# EAGLE board TestBoardTarget (EAGLE 7.1.0)
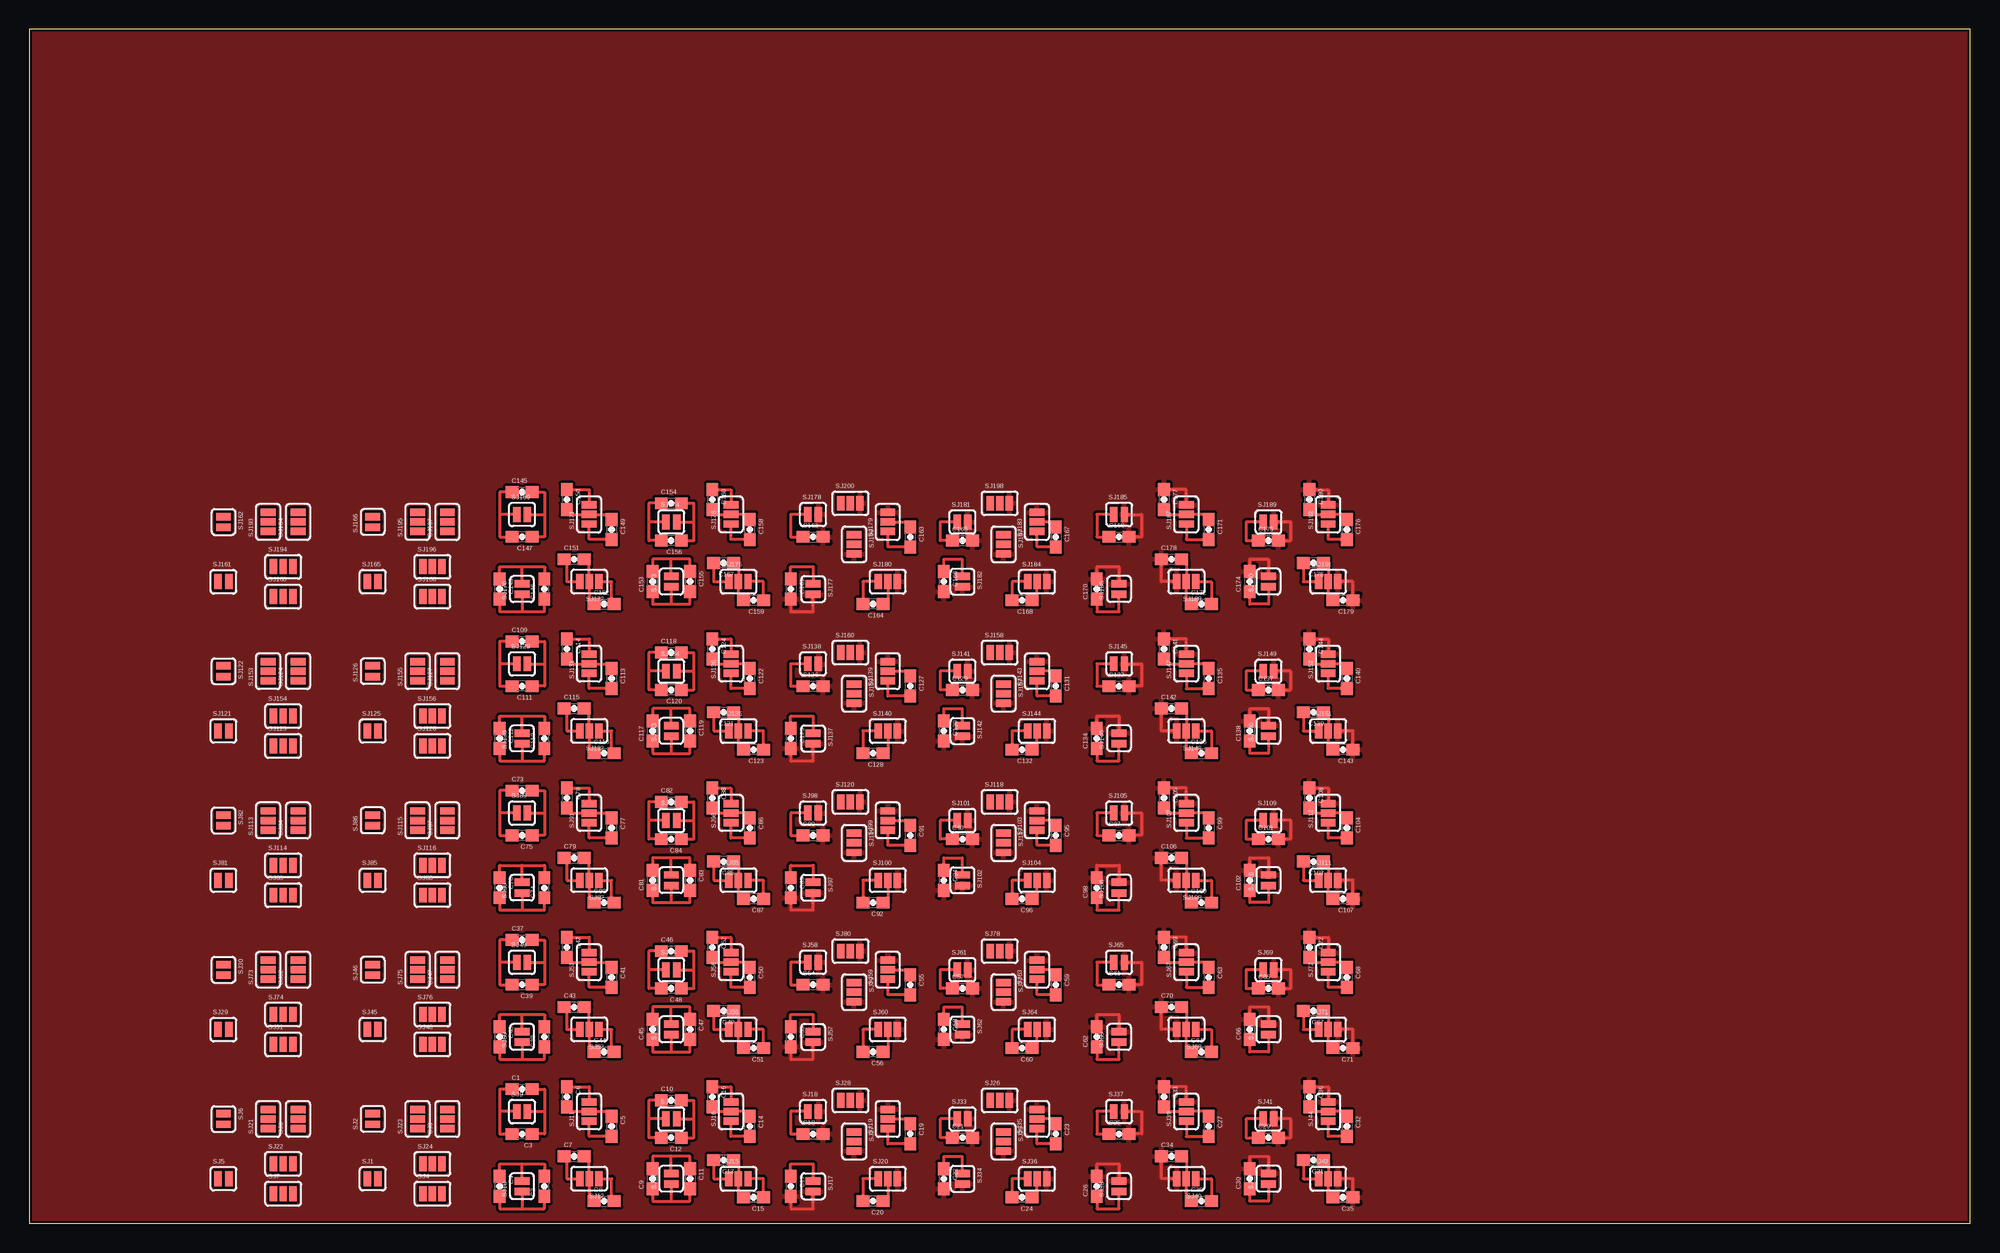
[diagram p3: board, top side]

Size 165.1 x 101.6 mm. Coordinates in mm from the lower left corner, seen from the top.
Outline: 0,0 165.1,0 165.1,101.6 0,101.6 0,0
Copper layers (1*16): Top 0.035mm / dielectric 1.5mm / Bottom 0.035mm
Design rules "SparkFun-2-layer": minimum track width 7mil, minimum drill 15mil, track to track 8mil, track to pad 8mil, pad to pad 8mil, via to via 8mil, smd to smd 8mil, copper to edge 8mil, drill to drill 8mil, minimum pad ring 12mil, minimum via ring 10mil, stop-mask expansion 4mil, vias tented up to drill 20mil, thermal gap 10mil

## Footprints (pad centres in the part's own frame; a part is rotated, then mirrored left to right if it is on the bottom)
0603-CAP = smd 1.1 x 1: 1 -0.85,0; 2 0.85,0
PAD-JUMPER-2-NO_NO_SILK = smd 0.635 x 1.27: 1 -0.45,0; 2 0.45,0
PAD-JUMPER-3-NO_YES_SILK = smd 0.635 x 1.27: 1 -0.813,0; 2 0,0; 3 0.813,0
PAD-JUMPER-3-NO_YES_SILK_ALL = smd 0.635 x 1.27: 1 -0.813,0; 2 0,0; 3 0.813,0
PAD-JUMPER-2-NO_NO_SILK_20 = smd 0.635 x 1.27: 1 -0.45,0; 2 0.45,0
PAD-JUMPER-3-NO_YES_SILK_20 = smd 0.635 x 1.27: 1 -0.813,0; 2 0,0; 3 0.813,0
PAD-JUMPER-3-NO_YES_SILK_ALL_20 = smd 0.635 x 1.27: 1 -0.813,0; 2 0,0; 3 0.813,0
PAD-JUMPER-2-NO_NO_SILK_40 = smd 0.635 x 1.27: 1 -0.45,0; 2 0.45,0
PAD-JUMPER-3-NO_YES_SILK_40 = smd 0.635 x 1.27: 1 -0.813,0; 2 0,0; 3 0.813,0
PAD-JUMPER-3-NO_YES_SILK_ALL_40 = smd 0.635 x 1.27: 1 -0.813,0; 2 0,0; 3 0.813,0
PAD-JUMPER-2-NO_NO_SILK_60 = smd 0.635 x 1.27: 1 -0.45,0; 2 0.45,0
PAD-JUMPER-3-NO_YES_SILK_60 = smd 0.635 x 1.27: 1 -0.813,0; 2 0,0; 3 0.813,0
PAD-JUMPER-3-NO_YES_SILK_ALL_60 = smd 0.635 x 1.27: 1 -0.813,0; 2 0,0; 3 0.813,0
PAD-JUMPER-2-NO_NO_SILK_80 = smd 0.635 x 1.27: 1 -0.45,0; 2 0.45,0
PAD-JUMPER-3-NO_YES_SILK_80 = smd 0.635 x 1.27: 1 -0.813,0; 2 0,0; 3 0.813,0
PAD-JUMPER-3-NO_YES_SILK_ALL_80 = smd 0.635 x 1.27: 1 -0.813,0; 2 0,0; 3 0.813,0

## Placement (x,y rotation side)
C1  0.1uF  [0603-CAP]  41.91,11.43 0 top
C2  0.1uF  [0603-CAP]  43.81,3.17 90 top
C3  0.1uF  [0603-CAP]  41.91,7.62 180 top
C4  0.1uF  [0603-CAP]  40.01,3.17 270 top
C5  0.1uF  [0603-CAP]  49.53,8.26 270 top
C6  0.1uF  [0603-CAP]  45.72,10.79 270 top
C7  0.1uF  [0603-CAP]  46.35,5.71 0 top
C8  0.1uF  [0603-CAP]  48.9,1.91 0 top
C9  0.1uF  [0603-CAP]  53.02,3.81 90 top
C10  0.1uF  [0603-CAP]  54.61,10.48 0 top
C11  0.1uF  [0603-CAP]  56.2,3.81 270 top
C12  0.1uF  [0603-CAP]  54.61,7.3 180 top
C13  0.1uF  [0603-CAP]  59.05,5.4 180 top
C14  0.1uF  [0603-CAP]  61.28,8.26 270 top
C15  0.1uF  [0603-CAP]  61.59,2.22 180 top
C16  0.1uF  [0603-CAP]  58.1,10.79 270 top
C17  0.1uF  [0603-CAP]  64.77,3.17 270 top
C18  0.1uF  [0603-CAP]  66.67,7.62 0 top
C19  0.1uF  [0603-CAP]  74.93,7.62 270 top
C20  0.1uF  [0603-CAP]  71.75,1.91 180 top
C21  0.1uF  [0603-CAP]  79.38,7.3 0 top
C22  0.1uF  [0603-CAP]  77.79,3.81 270 top
C23  0.1uF  [0603-CAP]  87.31,7.62 270 top
C24  0.1uF  [0603-CAP]  84.45,2.22 180 top
C25  0.1uF  [0603-CAP]  92.71,7.62 0 top
C26  0.1uF  [0603-CAP]  90.81,3.17 90 top
C27  0.1uF  [0603-CAP]  100.33,8.26 270 top
C28  0.1uF  [0603-CAP]  99.69,1.91 0 top
C29  0.1uF  [0603-CAP]  105.41,7.3 0 top
C30  0.1uF  [0603-CAP]  103.82,3.81 90 top
C31  0.1uF  [0603-CAP]  109.22,5.4 180 top
C32  0.1uF  [0603-CAP]  112.08,8.26 270 top
C33  0.1uF  [0603-CAP]  96.52,10.79 270 top
C34  0.1uF  [0603-CAP]  97.16,5.71 0 top
C35  0.1uF  [0603-CAP]  111.76,2.22 180 top
C36  0.1uF  [0603-CAP]  108.9,10.79 270 top
C37  0.1uF  [0603-CAP]  41.91,24.13 0 top
C38  0.1uF  [0603-CAP]  43.81,15.88 90 top
C39  0.1uF  [0603-CAP]  41.91,20.32 180 top
C40  0.1uF  [0603-CAP]  40.01,15.88 270 top
C41  0.1uF  [0603-CAP]  49.53,20.95 270 top
C42  0.1uF  [0603-CAP]  45.72,23.5 270 top
C43  0.1uF  [0603-CAP]  46.35,18.41 0 top
C44  0.1uF  [0603-CAP]  48.9,14.61 0 top
C45  0.1uF  [0603-CAP]  53.02,16.51 90 top
C46  0.1uF  [0603-CAP]  54.61,23.18 0 top
C47  0.1uF  [0603-CAP]  56.2,16.51 270 top
C48  0.1uF  [0603-CAP]  54.61,20 180 top
C49  0.1uF  [0603-CAP]  59.05,18.1 180 top
C50  0.1uF  [0603-CAP]  61.28,20.95 270 top
C51  0.1uF  [0603-CAP]  61.59,14.92 180 top
C52  0.1uF  [0603-CAP]  58.1,23.5 270 top
C53  0.1uF  [0603-CAP]  64.77,15.88 270 top
C54  0.1uF  [0603-CAP]  66.67,20.32 0 top
C55  0.1uF  [0603-CAP]  74.93,20.32 270 top
C56  0.1uF  [0603-CAP]  71.75,14.61 180 top
C57  0.1uF  [0603-CAP]  79.38,20 0 top
C58  0.1uF  [0603-CAP]  77.79,16.51 270 top
C59  0.1uF  [0603-CAP]  87.31,20.32 270 top
C60  0.1uF  [0603-CAP]  84.45,14.92 180 top
C61  0.1uF  [0603-CAP]  92.71,20.32 0 top
C62  0.1uF  [0603-CAP]  90.81,15.88 90 top
C63  0.1uF  [0603-CAP]  100.33,20.95 270 top
C64  0.1uF  [0603-CAP]  99.69,14.61 0 top
C65  0.1uF  [0603-CAP]  105.41,20 0 top
C66  0.1uF  [0603-CAP]  103.82,16.51 90 top
C67  0.1uF  [0603-CAP]  109.22,18.1 180 top
C68  0.1uF  [0603-CAP]  112.08,20.95 270 top
C69  0.1uF  [0603-CAP]  96.52,23.5 270 top
C70  0.1uF  [0603-CAP]  97.16,18.41 0 top
C71  0.1uF  [0603-CAP]  111.76,14.92 180 top
C72  0.1uF  [0603-CAP]  108.9,23.5 270 top
C73  0.1uF  [0603-CAP]  41.91,36.83 0 top
C74  0.1uF  [0603-CAP]  43.81,28.57 90 top
C75  0.1uF  [0603-CAP]  41.91,33.02 180 top
C76  0.1uF  [0603-CAP]  40.01,28.57 270 top
C77  0.1uF  [0603-CAP]  49.53,33.66 270 top
C78  0.1uF  [0603-CAP]  45.72,36.2 270 top
C79  0.1uF  [0603-CAP]  46.35,31.11 0 top
C80  0.1uF  [0603-CAP]  48.9,27.3 0 top
C81  0.1uF  [0603-CAP]  53.02,29.21 90 top
C82  0.1uF  [0603-CAP]  54.61,35.88 0 top
C83  0.1uF  [0603-CAP]  56.2,29.21 270 top
C84  0.1uF  [0603-CAP]  54.61,32.7 180 top
C85  0.1uF  [0603-CAP]  59.05,30.8 180 top
C86  0.1uF  [0603-CAP]  61.28,33.66 270 top
C87  0.1uF  [0603-CAP]  61.59,27.62 180 top
C88  0.1uF  [0603-CAP]  58.1,36.2 270 top
C89  0.1uF  [0603-CAP]  64.77,28.57 270 top
C90  0.1uF  [0603-CAP]  66.67,33.02 0 top
C91  0.1uF  [0603-CAP]  74.93,33.02 270 top
C92  0.1uF  [0603-CAP]  71.75,27.3 180 top
C93  0.1uF  [0603-CAP]  79.38,32.7 0 top
C94  0.1uF  [0603-CAP]  77.79,29.21 270 top
C95  0.1uF  [0603-CAP]  87.31,33.02 270 top
C96  0.1uF  [0603-CAP]  84.45,27.62 180 top
C97  0.1uF  [0603-CAP]  92.71,33.02 0 top
C98  0.1uF  [0603-CAP]  90.81,28.57 90 top
C99  0.1uF  [0603-CAP]  100.33,33.66 270 top
C100  0.1uF  [0603-CAP]  99.69,27.3 0 top
C101  0.1uF  [0603-CAP]  105.41,32.7 0 top
C102  0.1uF  [0603-CAP]  103.82,29.21 90 top
C103  0.1uF  [0603-CAP]  109.22,30.8 180 top
C104  0.1uF  [0603-CAP]  112.08,33.66 270 top
C105  0.1uF  [0603-CAP]  96.52,36.2 270 top
C106  0.1uF  [0603-CAP]  97.16,31.11 0 top
C107  0.1uF  [0603-CAP]  111.76,27.62 180 top
C108  0.1uF  [0603-CAP]  108.9,36.2 270 top
C109  0.1uF  [0603-CAP]  41.91,49.53 0 top
C110  0.1uF  [0603-CAP]  43.81,41.27 90 top
C111  0.1uF  [0603-CAP]  41.91,45.72 180 top
C112  0.1uF  [0603-CAP]  40.01,41.27 270 top
C113  0.1uF  [0603-CAP]  49.53,46.35 270 top
C114  0.1uF  [0603-CAP]  45.72,48.9 270 top
C115  0.1uF  [0603-CAP]  46.35,43.81 0 top
C116  0.1uF  [0603-CAP]  48.9,40.01 0 top
C117  0.1uF  [0603-CAP]  53.02,41.91 90 top
C118  0.1uF  [0603-CAP]  54.61,48.58 0 top
C119  0.1uF  [0603-CAP]  56.2,41.91 270 top
C120  0.1uF  [0603-CAP]  54.61,45.4 180 top
C121  0.1uF  [0603-CAP]  59.05,43.5 180 top
C122  0.1uF  [0603-CAP]  61.28,46.35 270 top
C123  0.1uF  [0603-CAP]  61.59,40.32 180 top
C124  0.1uF  [0603-CAP]  58.1,48.9 270 top
C125  0.1uF  [0603-CAP]  64.77,41.27 270 top
C126  0.1uF  [0603-CAP]  66.67,45.72 0 top
C127  0.1uF  [0603-CAP]  74.93,45.72 270 top
C128  0.1uF  [0603-CAP]  71.75,40.01 180 top
C129  0.1uF  [0603-CAP]  79.38,45.4 0 top
C130  0.1uF  [0603-CAP]  77.79,41.91 270 top
C131  0.1uF  [0603-CAP]  87.31,45.72 270 top
C132  0.1uF  [0603-CAP]  84.45,40.32 180 top
C133  0.1uF  [0603-CAP]  92.71,45.72 0 top
C134  0.1uF  [0603-CAP]  90.81,41.27 90 top
C135  0.1uF  [0603-CAP]  100.33,46.35 270 top
C136  0.1uF  [0603-CAP]  99.69,40.01 0 top
C137  0.1uF  [0603-CAP]  105.41,45.4 0 top
C138  0.1uF  [0603-CAP]  103.82,41.91 90 top
C139  0.1uF  [0603-CAP]  109.22,43.5 180 top
C140  0.1uF  [0603-CAP]  112.08,46.35 270 top
C141  0.1uF  [0603-CAP]  96.52,48.9 270 top
C142  0.1uF  [0603-CAP]  97.16,43.81 0 top
C143  0.1uF  [0603-CAP]  111.76,40.32 180 top
C144  0.1uF  [0603-CAP]  108.9,48.9 270 top
C145  0.1uF  [0603-CAP]  41.91,62.23 0 top
C146  0.1uF  [0603-CAP]  43.81,53.98 90 top
C147  0.1uF  [0603-CAP]  41.91,58.42 180 top
C148  0.1uF  [0603-CAP]  40.01,53.98 270 top
C149  0.1uF  [0603-CAP]  49.53,59.05 270 top
C150  0.1uF  [0603-CAP]  45.72,61.59 270 top
C151  0.1uF  [0603-CAP]  46.35,56.52 0 top
C152  0.1uF  [0603-CAP]  48.9,52.7 0 top
C153  0.1uF  [0603-CAP]  53.02,54.61 90 top
C154  0.1uF  [0603-CAP]  54.61,61.28 0 top
C155  0.1uF  [0603-CAP]  56.2,54.61 270 top
C156  0.1uF  [0603-CAP]  54.61,58.1 180 top
C157  0.1uF  [0603-CAP]  59.05,56.2 180 top
C158  0.1uF  [0603-CAP]  61.28,59.05 270 top
C159  0.1uF  [0603-CAP]  61.59,53.02 180 top
C160  0.1uF  [0603-CAP]  58.1,61.59 270 top
C161  0.1uF  [0603-CAP]  64.77,53.98 270 top
C162  0.1uF  [0603-CAP]  66.67,58.42 0 top
C163  0.1uF  [0603-CAP]  74.93,58.42 270 top
C164  0.1uF  [0603-CAP]  71.75,52.7 180 top
C165  0.1uF  [0603-CAP]  79.38,58.1 0 top
C166  0.1uF  [0603-CAP]  77.79,54.61 270 top
C167  0.1uF  [0603-CAP]  87.31,58.42 270 top
C168  0.1uF  [0603-CAP]  84.45,53.02 180 top
C169  0.1uF  [0603-CAP]  92.71,58.42 0 top
C170  0.1uF  [0603-CAP]  90.81,53.98 90 top
C171  0.1uF  [0603-CAP]  100.33,59.05 270 top
C172  0.1uF  [0603-CAP]  99.69,52.7 0 top
C173  0.1uF  [0603-CAP]  105.41,58.1 0 top
C174  0.1uF  [0603-CAP]  103.82,54.61 90 top
C175  0.1uF  [0603-CAP]  109.22,56.2 180 top
C176  0.1uF  [0603-CAP]  112.08,59.05 270 top
C177  0.1uF  [0603-CAP]  96.52,61.59 270 top
C178  0.1uF  [0603-CAP]  97.16,56.52 0 top
C179  0.1uF  [0603-CAP]  111.76,53.02 180 top
C180  0.1uF  [0603-CAP]  108.9,61.59 270 top
SJ1  JUMPER-PAD-2-NO  [PAD-JUMPER-2-NO_NO_SILK]  29.21,3.81 0 top
SJ2  JUMPER-PAD-2-NO  [PAD-JUMPER-2-NO_NO_SILK]  29.21,8.89 90 top
SJ3  JUMPER-PAD-3-NOYES_SILK  [PAD-JUMPER-3-NO_YES_SILK]  35.56,8.89 90 top
SJ4  JUMPER-PAD-3-NOYES_SILK  [PAD-JUMPER-3-NO_YES_SILK]  34.29,2.54 0 top
SJ5  JUMPER-PAD-2-NO  [PAD-JUMPER-2-NO_NO_SILK]  16.51,3.81 0 top
SJ6  JUMPER-PAD-2-NO  [PAD-JUMPER-2-NO_NO_SILK]  16.51,8.89 270 top
SJ7  JUMPER-PAD-3-NOYES_SILK  [PAD-JUMPER-3-NO_YES_SILK]  21.59,2.54 0 top
SJ8  JUMPER-PAD-3-NOYES_SILK  [PAD-JUMPER-3-NO_YES_SILK]  22.86,8.89 90 top
SJ9  JUMPER-PAD-2-NO  [PAD-JUMPER-2-NO_NO_SILK]  41.91,9.53 0 top
SJ10  JUMPER-PAD-2-NO  [PAD-JUMPER-2-NO_NO_SILK]  41.91,3.17 90 top
SJ11  JUMPER-PAD-3-NOYES_SILK  [PAD-JUMPER-3-NO_YES_SILK]  47.62,9.53 90 top
SJ12  JUMPER-PAD-3-NOYES_SILK  [PAD-JUMPER-3-NO_YES_SILK]  47.62,3.81 180 top
SJ13  JUMPER-PAD-2-NO  [PAD-JUMPER-2-NO_NO_SILK]  54.61,3.81 90 top
SJ14  JUMPER-PAD-2-NO  [PAD-JUMPER-2-NO_NO_SILK]  54.61,8.89 0 top
SJ15  JUMPER-PAD-3-NOYES_SILK  [PAD-JUMPER-3-NO_YES_SILK]  60.33,3.81 0 top
SJ16  JUMPER-PAD-3-NOYES_SILK  [PAD-JUMPER-3-NO_YES_SILK]  59.69,9.53 90 top
SJ17  JUMPER-PAD-2-NO  [PAD-JUMPER-2-NO_NO_SILK]  66.67,3.17 270 top
SJ18  JUMPER-PAD-2-NO  [PAD-JUMPER-2-NO_NO_SILK]  66.67,9.53 0 top
SJ19  JUMPER-PAD-3-NOYES_SILK  [PAD-JUMPER-3-NO_YES_SILK]  73.03,8.89 90 top
SJ20  JUMPER-PAD-3-NOYES_SILK  [PAD-JUMPER-3-NO_YES_SILK]  73.03,3.81 0 top
SJ21  JUMPER-PAD-3-NOYES_SILK  [PAD-JUMPER-3-NO_YES_SILK]  20.32,8.89 90 top
SJ22  JUMPER-PAD-3-NOYES_SILK  [PAD-JUMPER-3-NO_YES_SILK]  21.59,5.08 0 top
SJ23  JUMPER-PAD-3-NOYES_SILK  [PAD-JUMPER-3-NO_YES_SILK]  33.02,8.89 90 top
SJ24  JUMPER-PAD-3-NOYES_SILK  [PAD-JUMPER-3-NO_YES_SILK]  34.29,5.08 0 top
SJ25  JUMPER-PAD-3-NO3_0  [PAD-JUMPER-3-NO_YES_SILK_ALL]  82.87,6.99 270 top
SJ26  JUMPER-PAD-3-NO3_0  [PAD-JUMPER-3-NO_YES_SILK_ALL]  82.55,10.48 0 top
SJ27  JUMPER-PAD-3-NO3_0  [PAD-JUMPER-3-NO_YES_SILK_ALL]  70.17,6.99 270 top
SJ28  JUMPER-PAD-3-NO3_0  [PAD-JUMPER-3-NO_YES_SILK_ALL]  69.85,10.48 0 top
SJ29  JUMPER-PAD-2-NO20  [PAD-JUMPER-2-NO_NO_SILK_20]  16.51,16.51 0 top
SJ30  JUMPER-PAD-2-NO20  [PAD-JUMPER-2-NO_NO_SILK_20]  16.51,21.59 270 top
SJ31  JUMPER-PAD-3-NO2_20  [PAD-JUMPER-3-NO_YES_SILK_20]  21.59,15.24 0 top
SJ32  JUMPER-PAD-3-NO2_20  [PAD-JUMPER-3-NO_YES_SILK_20]  22.86,21.59 90 top
SJ33  JUMPER-PAD-2-NO  [PAD-JUMPER-2-NO_NO_SILK]  79.38,8.89 0 top
SJ34  JUMPER-PAD-2-NO  [PAD-JUMPER-2-NO_NO_SILK]  79.38,3.81 270 top
SJ35  JUMPER-PAD-3-NOYES_SILK  [PAD-JUMPER-3-NO_YES_SILK]  85.72,8.89 90 top
SJ36  JUMPER-PAD-3-NOYES_SILK  [PAD-JUMPER-3-NO_YES_SILK]  85.72,3.81 0 top
SJ37  JUMPER-PAD-2-NO  [PAD-JUMPER-2-NO_NO_SILK]  92.71,9.53 0 top
SJ38  JUMPER-PAD-2-NO  [PAD-JUMPER-2-NO_NO_SILK]  92.71,3.17 90 top
SJ39  JUMPER-PAD-3-NOYES_SILK  [PAD-JUMPER-3-NO_YES_SILK]  98.42,9.53 90 top
SJ40  JUMPER-PAD-3-NOYES_SILK  [PAD-JUMPER-3-NO_YES_SILK]  98.42,3.81 180 top
SJ41  JUMPER-PAD-2-NO  [PAD-JUMPER-2-NO_NO_SILK]  105.41,8.89 0 top
SJ42  JUMPER-PAD-2-NO  [PAD-JUMPER-2-NO_NO_SILK]  105.41,3.81 90 top
SJ43  JUMPER-PAD-3-NOYES_SILK  [PAD-JUMPER-3-NO_YES_SILK]  110.49,3.81 0 top
SJ44  JUMPER-PAD-3-NOYES_SILK  [PAD-JUMPER-3-NO_YES_SILK]  110.49,9.53 90 top
SJ45  JUMPER-PAD-2-NO20  [PAD-JUMPER-2-NO_NO_SILK_20]  29.21,16.51 0 top
SJ46  JUMPER-PAD-2-NO20  [PAD-JUMPER-2-NO_NO_SILK_20]  29.21,21.59 90 top
SJ47  JUMPER-PAD-3-NO2_20  [PAD-JUMPER-3-NO_YES_SILK_20]  35.56,21.59 90 top
SJ48  JUMPER-PAD-3-NO2_20  [PAD-JUMPER-3-NO_YES_SILK_20]  34.29,15.24 0 top
SJ49  JUMPER-PAD-2-NO20  [PAD-JUMPER-2-NO_NO_SILK_20]  41.91,22.23 0 top
SJ50  JUMPER-PAD-2-NO20  [PAD-JUMPER-2-NO_NO_SILK_20]  41.91,15.88 90 top
SJ51  JUMPER-PAD-3-NO2_20  [PAD-JUMPER-3-NO_YES_SILK_20]  47.62,22.23 90 top
SJ52  JUMPER-PAD-3-NO2_20  [PAD-JUMPER-3-NO_YES_SILK_20]  47.62,16.51 180 top
SJ53  JUMPER-PAD-2-NO20  [PAD-JUMPER-2-NO_NO_SILK_20]  54.61,16.51 90 top
SJ54  JUMPER-PAD-2-NO20  [PAD-JUMPER-2-NO_NO_SILK_20]  54.61,21.59 0 top
SJ55  JUMPER-PAD-3-NO2_20  [PAD-JUMPER-3-NO_YES_SILK_20]  60.33,16.51 0 top
SJ56  JUMPER-PAD-3-NO2_20  [PAD-JUMPER-3-NO_YES_SILK_20]  59.69,22.23 90 top
SJ57  JUMPER-PAD-2-NO20  [PAD-JUMPER-2-NO_NO_SILK_20]  66.67,15.88 270 top
SJ58  JUMPER-PAD-2-NO20  [PAD-JUMPER-2-NO_NO_SILK_20]  66.67,22.23 0 top
SJ59  JUMPER-PAD-3-NO2_20  [PAD-JUMPER-3-NO_YES_SILK_20]  73.03,21.59 90 top
SJ60  JUMPER-PAD-3-NO2_20  [PAD-JUMPER-3-NO_YES_SILK_20]  73.03,16.51 0 top
SJ61  JUMPER-PAD-2-NO20  [PAD-JUMPER-2-NO_NO_SILK_20]  79.38,21.59 0 top
SJ62  JUMPER-PAD-2-NO20  [PAD-JUMPER-2-NO_NO_SILK_20]  79.38,16.51 270 top
SJ63  JUMPER-PAD-3-NO2_20  [PAD-JUMPER-3-NO_YES_SILK_20]  85.72,21.59 90 top
SJ64  JUMPER-PAD-3-NO2_20  [PAD-JUMPER-3-NO_YES_SILK_20]  85.72,16.51 0 top
SJ65  JUMPER-PAD-2-NO20  [PAD-JUMPER-2-NO_NO_SILK_20]  92.71,22.23 0 top
SJ66  JUMPER-PAD-2-NO20  [PAD-JUMPER-2-NO_NO_SILK_20]  92.71,15.88 90 top
SJ67  JUMPER-PAD-3-NO2_20  [PAD-JUMPER-3-NO_YES_SILK_20]  98.42,22.23 90 top
SJ68  JUMPER-PAD-3-NO2_20  [PAD-JUMPER-3-NO_YES_SILK_20]  98.42,16.51 180 top
SJ69  JUMPER-PAD-2-NO  [PAD-JUMPER-2-NO_NO_SILK]  105.41,21.59 0 top
SJ70  JUMPER-PAD-2-NO  [PAD-JUMPER-2-NO_NO_SILK]  105.41,16.51 90 top
SJ71  JUMPER-PAD-3-NO2_20  [PAD-JUMPER-3-NO_YES_SILK_20]  110.49,16.51 0 top
SJ72  JUMPER-PAD-3-NO2_20  [PAD-JUMPER-3-NO_YES_SILK_20]  110.49,22.23 90 top
SJ73  JUMPER-PAD-3-NOYES_SILK  [PAD-JUMPER-3-NO_YES_SILK]  20.32,21.59 90 top
SJ74  JUMPER-PAD-3-NOYES_SILK  [PAD-JUMPER-3-NO_YES_SILK]  21.59,17.78 0 top
SJ75  JUMPER-PAD-3-NOYES_SILK  [PAD-JUMPER-3-NO_YES_SILK]  33.02,21.59 90 top
SJ76  JUMPER-PAD-3-NOYES_SILK  [PAD-JUMPER-3-NO_YES_SILK]  34.29,17.78 0 top
SJ77  JUMPER-PAD-3-NO3_20  [PAD-JUMPER-3-NO_YES_SILK_ALL_20]  82.87,19.68 270 top
SJ78  JUMPER-PAD-3-NO3_20  [PAD-JUMPER-3-NO_YES_SILK_ALL_20]  82.55,23.18 0 top
SJ79  JUMPER-PAD-3-NO3_20  [PAD-JUMPER-3-NO_YES_SILK_ALL_20]  70.17,19.68 270 top
SJ80  JUMPER-PAD-3-NO3_20  [PAD-JUMPER-3-NO_YES_SILK_ALL_20]  69.85,23.18 0 top
SJ81  JUMPER-PAD-2-NO40  [PAD-JUMPER-2-NO_NO_SILK_40]  16.51,29.21 0 top
SJ82  JUMPER-PAD-2-NO40  [PAD-JUMPER-2-NO_NO_SILK_40]  16.51,34.29 270 top
SJ83  JUMPER-PAD-3-NO2_40  [PAD-JUMPER-3-NO_YES_SILK_40]  21.59,27.94 0 top
SJ84  JUMPER-PAD-3-NO2_40  [PAD-JUMPER-3-NO_YES_SILK_40]  22.86,34.29 90 top
SJ85  JUMPER-PAD-2-NO40  [PAD-JUMPER-2-NO_NO_SILK_40]  29.21,29.21 0 top
SJ86  JUMPER-PAD-2-NO40  [PAD-JUMPER-2-NO_NO_SILK_40]  29.21,34.29 90 top
SJ87  JUMPER-PAD-3-NO2_40  [PAD-JUMPER-3-NO_YES_SILK_40]  35.56,34.29 90 top
SJ88  JUMPER-PAD-3-NO2_40  [PAD-JUMPER-3-NO_YES_SILK_40]  34.29,27.94 0 top
SJ89  JUMPER-PAD-2-NO40  [PAD-JUMPER-2-NO_NO_SILK_40]  41.91,34.92 0 top
SJ90  JUMPER-PAD-2-NO40  [PAD-JUMPER-2-NO_NO_SILK_40]  41.91,28.57 90 top
SJ91  JUMPER-PAD-3-NO2_40  [PAD-JUMPER-3-NO_YES_SILK_40]  47.62,34.92 90 top
SJ92  JUMPER-PAD-3-NO2_40  [PAD-JUMPER-3-NO_YES_SILK_40]  47.62,29.21 180 top
SJ93  JUMPER-PAD-2-NO40  [PAD-JUMPER-2-NO_NO_SILK_40]  54.61,29.21 90 top
SJ94  JUMPER-PAD-2-NO40  [PAD-JUMPER-2-NO_NO_SILK_40]  54.61,34.29 0 top
SJ95  JUMPER-PAD-3-NO2_40  [PAD-JUMPER-3-NO_YES_SILK_40]  60.33,29.21 0 top
SJ96  JUMPER-PAD-3-NO2_40  [PAD-JUMPER-3-NO_YES_SILK_40]  59.69,34.92 90 top
SJ97  JUMPER-PAD-2-NO40  [PAD-JUMPER-2-NO_NO_SILK_40]  66.67,28.57 270 top
SJ98  JUMPER-PAD-2-NO40  [PAD-JUMPER-2-NO_NO_SILK_40]  66.67,34.92 0 top
SJ99  JUMPER-PAD-3-NO2_40  [PAD-JUMPER-3-NO_YES_SILK_40]  73.03,34.29 90 top
SJ100  JUMPER-PAD-3-NO2_40  [PAD-JUMPER-3-NO_YES_SILK_40]  73.03,29.21 0 top
SJ101  JUMPER-PAD-2-NO40  [PAD-JUMPER-2-NO_NO_SILK_40]  79.38,34.29 0 top
SJ102  JUMPER-PAD-2-NO40  [PAD-JUMPER-2-NO_NO_SILK_40]  79.38,29.21 270 top
SJ103  JUMPER-PAD-3-NO2_40  [PAD-JUMPER-3-NO_YES_SILK_40]  85.72,34.29 90 top
SJ104  JUMPER-PAD-3-NO2_40  [PAD-JUMPER-3-NO_YES_SILK_40]  85.72,29.21 0 top
SJ105  JUMPER-PAD-2-NO40  [PAD-JUMPER-2-NO_NO_SILK_40]  92.71,34.92 0 top
SJ106  JUMPER-PAD-2-NO40  [PAD-JUMPER-2-NO_NO_SILK_40]  92.71,28.57 90 top
SJ107  JUMPER-PAD-3-NO2_40  [PAD-JUMPER-3-NO_YES_SILK_40]  98.42,34.92 90 top
SJ108  JUMPER-PAD-3-NO2_40  [PAD-JUMPER-3-NO_YES_SILK_40]  98.42,29.21 180 top
SJ109  JUMPER-PAD-2-NO40  [PAD-JUMPER-2-NO_NO_SILK_40]  105.41,34.29 0 top
SJ110  JUMPER-PAD-2-NO40  [PAD-JUMPER-2-NO_NO_SILK_40]  105.41,29.21 90 top
SJ111  JUMPER-PAD-3-NO2_40  [PAD-JUMPER-3-NO_YES_SILK_40]  110.49,29.21 0 top
SJ112  JUMPER-PAD-3-NO2_40  [PAD-JUMPER-3-NO_YES_SILK_40]  110.49,34.92 90 top
SJ113  JUMPER-PAD-3-NO3_40  [PAD-JUMPER-3-NO_YES_SILK_ALL_40]  20.32,34.29 90 top
SJ114  JUMPER-PAD-3-NO3_40  [PAD-JUMPER-3-NO_YES_SILK_ALL_40]  21.59,30.48 0 top
SJ115  JUMPER-PAD-3-NO3_40  [PAD-JUMPER-3-NO_YES_SILK_ALL_40]  33.02,34.29 90 top
SJ116  JUMPER-PAD-3-NO3_40  [PAD-JUMPER-3-NO_YES_SILK_ALL_40]  34.29,30.48 0 top
SJ117  JUMPER-PAD-3-NO3_40  [PAD-JUMPER-3-NO_YES_SILK_ALL_40]  82.87,32.38 270 top
SJ118  JUMPER-PAD-3-NO3_40  [PAD-JUMPER-3-NO_YES_SILK_ALL_40]  82.55,35.88 0 top
SJ119  JUMPER-PAD-3-NO3_40  [PAD-JUMPER-3-NO_YES_SILK_ALL_40]  70.17,32.38 270 top
SJ120  JUMPER-PAD-3-NO3_40  [PAD-JUMPER-3-NO_YES_SILK_ALL_40]  69.85,35.88 0 top
SJ121  JUMPER-PAD-2-NO60  [PAD-JUMPER-2-NO_NO_SILK_60]  16.51,41.91 0 top
SJ122  JUMPER-PAD-2-NO60  [PAD-JUMPER-2-NO_NO_SILK_60]  16.51,46.99 270 top
SJ123  JUMPER-PAD-3-NO2_60  [PAD-JUMPER-3-NO_YES_SILK_60]  21.59,40.64 0 top
SJ124  JUMPER-PAD-3-NO2_60  [PAD-JUMPER-3-NO_YES_SILK_60]  22.86,46.99 90 top
SJ125  JUMPER-PAD-2-NO60  [PAD-JUMPER-2-NO_NO_SILK_60]  29.21,41.91 0 top
SJ126  JUMPER-PAD-2-NO60  [PAD-JUMPER-2-NO_NO_SILK_60]  29.21,46.99 90 top
SJ127  JUMPER-PAD-3-NO2_60  [PAD-JUMPER-3-NO_YES_SILK_60]  35.56,46.99 90 top
SJ128  JUMPER-PAD-3-NO2_60  [PAD-JUMPER-3-NO_YES_SILK_60]  34.29,40.64 0 top
SJ129  JUMPER-PAD-2-NO60  [PAD-JUMPER-2-NO_NO_SILK_60]  41.91,47.62 0 top
SJ130  JUMPER-PAD-2-NO60  [PAD-JUMPER-2-NO_NO_SILK_60]  41.91,41.27 90 top
SJ131  JUMPER-PAD-3-NO2_60  [PAD-JUMPER-3-NO_YES_SILK_60]  47.62,47.62 90 top
SJ132  JUMPER-PAD-3-NO2_60  [PAD-JUMPER-3-NO_YES_SILK_60]  47.62,41.91 180 top
SJ133  JUMPER-PAD-2-NO60  [PAD-JUMPER-2-NO_NO_SILK_60]  54.61,41.91 90 top
SJ134  JUMPER-PAD-2-NO60  [PAD-JUMPER-2-NO_NO_SILK_60]  54.61,46.99 0 top
SJ135  JUMPER-PAD-3-NO2_60  [PAD-JUMPER-3-NO_YES_SILK_60]  60.33,41.91 0 top
SJ136  JUMPER-PAD-3-NO2_60  [PAD-JUMPER-3-NO_YES_SILK_60]  59.69,47.62 90 top
SJ137  JUMPER-PAD-2-NO60  [PAD-JUMPER-2-NO_NO_SILK_60]  66.67,41.27 270 top
SJ138  JUMPER-PAD-2-NO60  [PAD-JUMPER-2-NO_NO_SILK_60]  66.67,47.62 0 top
SJ139  JUMPER-PAD-3-NO2_60  [PAD-JUMPER-3-NO_YES_SILK_60]  73.03,46.99 90 top
SJ140  JUMPER-PAD-3-NO2_60  [PAD-JUMPER-3-NO_YES_SILK_60]  73.03,41.91 0 top
SJ141  JUMPER-PAD-2-NO60  [PAD-JUMPER-2-NO_NO_SILK_60]  79.38,46.99 0 top
SJ142  JUMPER-PAD-2-NO60  [PAD-JUMPER-2-NO_NO_SILK_60]  79.38,41.91 270 top
SJ143  JUMPER-PAD-3-NO2_60  [PAD-JUMPER-3-NO_YES_SILK_60]  85.72,46.99 90 top
SJ144  JUMPER-PAD-3-NO2_60  [PAD-JUMPER-3-NO_YES_SILK_60]  85.72,41.91 0 top
SJ145  JUMPER-PAD-2-NO60  [PAD-JUMPER-2-NO_NO_SILK_60]  92.71,47.62 0 top
SJ146  JUMPER-PAD-2-NO60  [PAD-JUMPER-2-NO_NO_SILK_60]  92.71,41.27 90 top
SJ147  JUMPER-PAD-3-NO2_60  [PAD-JUMPER-3-NO_YES_SILK_60]  98.42,47.62 90 top
SJ148  JUMPER-PAD-3-NO2_60  [PAD-JUMPER-3-NO_YES_SILK_60]  98.42,41.91 180 top
SJ149  JUMPER-PAD-2-NO60  [PAD-JUMPER-2-NO_NO_SILK_60]  105.41,46.99 0 top
SJ150  JUMPER-PAD-2-NO60  [PAD-JUMPER-2-NO_NO_SILK_60]  105.41,41.91 90 top
SJ151  JUMPER-PAD-3-NO2_60  [PAD-JUMPER-3-NO_YES_SILK_60]  110.49,41.91 0 top
SJ152  JUMPER-PAD-3-NO2_60  [PAD-JUMPER-3-NO_YES_SILK_60]  110.49,47.62 90 top
SJ153  JUMPER-PAD-3-NO3_60  [PAD-JUMPER-3-NO_YES_SILK_ALL_60]  20.32,46.99 90 top
SJ154  JUMPER-PAD-3-NO3_60  [PAD-JUMPER-3-NO_YES_SILK_ALL_60]  21.59,43.18 0 top
SJ155  JUMPER-PAD-3-NO3_60  [PAD-JUMPER-3-NO_YES_SILK_ALL_60]  33.02,46.99 90 top
SJ156  JUMPER-PAD-3-NO3_60  [PAD-JUMPER-3-NO_YES_SILK_ALL_60]  34.29,43.18 0 top
SJ157  JUMPER-PAD-3-NO3_60  [PAD-JUMPER-3-NO_YES_SILK_ALL_60]  82.87,45.09 270 top
SJ158  JUMPER-PAD-3-NO3_60  [PAD-JUMPER-3-NO_YES_SILK_ALL_60]  82.55,48.58 0 top
SJ159  JUMPER-PAD-3-NO3_60  [PAD-JUMPER-3-NO_YES_SILK_ALL_60]  70.17,45.09 270 top
SJ160  JUMPER-PAD-3-NO3_60  [PAD-JUMPER-3-NO_YES_SILK_ALL_60]  69.85,48.58 0 top
SJ161  JUMPER-PAD-2-NO80  [PAD-JUMPER-2-NO_NO_SILK_80]  16.51,54.61 0 top
SJ162  JUMPER-PAD-2-NO80  [PAD-JUMPER-2-NO_NO_SILK_80]  16.51,59.69 270 top
SJ163  JUMPER-PAD-3-NO2_80  [PAD-JUMPER-3-NO_YES_SILK_80]  21.59,53.34 0 top
SJ164  JUMPER-PAD-3-NO2_80  [PAD-JUMPER-3-NO_YES_SILK_80]  22.86,59.69 90 top
SJ165  JUMPER-PAD-2-NO80  [PAD-JUMPER-2-NO_NO_SILK_80]  29.21,54.61 0 top
SJ166  JUMPER-PAD-2-NO80  [PAD-JUMPER-2-NO_NO_SILK_80]  29.21,59.69 90 top
SJ167  JUMPER-PAD-3-NO2_80  [PAD-JUMPER-3-NO_YES_SILK_80]  35.56,59.69 90 top
SJ168  JUMPER-PAD-3-NO2_80  [PAD-JUMPER-3-NO_YES_SILK_80]  34.29,53.34 0 top
SJ169  JUMPER-PAD-2-NO80  [PAD-JUMPER-2-NO_NO_SILK_80]  41.91,60.33 0 top
SJ170  JUMPER-PAD-2-NO80  [PAD-JUMPER-2-NO_NO_SILK_80]  41.91,53.98 90 top
SJ171  JUMPER-PAD-3-NO2_80  [PAD-JUMPER-3-NO_YES_SILK_80]  47.62,60.33 90 top
SJ172  JUMPER-PAD-3-NO2_80  [PAD-JUMPER-3-NO_YES_SILK_80]  47.62,54.61 180 top
SJ173  JUMPER-PAD-2-NO80  [PAD-JUMPER-2-NO_NO_SILK_80]  54.61,54.61 90 top
SJ174  JUMPER-PAD-2-NO80  [PAD-JUMPER-2-NO_NO_SILK_80]  54.61,59.69 0 top
SJ175  JUMPER-PAD-3-NO2_80  [PAD-JUMPER-3-NO_YES_SILK_80]  60.33,54.61 0 top
SJ176  JUMPER-PAD-3-NO2_80  [PAD-JUMPER-3-NO_YES_SILK_80]  59.69,60.33 90 top
SJ177  JUMPER-PAD-2-NO80  [PAD-JUMPER-2-NO_NO_SILK_80]  66.67,53.98 270 top
SJ178  JUMPER-PAD-2-NO80  [PAD-JUMPER-2-NO_NO_SILK_80]  66.67,60.33 0 top
SJ179  JUMPER-PAD-3-NO2_80  [PAD-JUMPER-3-NO_YES_SILK_80]  73.03,59.69 90 top
SJ180  JUMPER-PAD-3-NO2_80  [PAD-JUMPER-3-NO_YES_SILK_80]  73.03,54.61 0 top
SJ181  JUMPER-PAD-2-NO80  [PAD-JUMPER-2-NO_NO_SILK_80]  79.38,59.69 0 top
SJ182  JUMPER-PAD-2-NO80  [PAD-JUMPER-2-NO_NO_SILK_80]  79.38,54.61 270 top
SJ183  JUMPER-PAD-3-NO2_80  [PAD-JUMPER-3-NO_YES_SILK_80]  85.72,59.69 90 top
SJ184  JUMPER-PAD-3-NO2_80  [PAD-JUMPER-3-NO_YES_SILK_80]  85.72,54.61 0 top
SJ185  JUMPER-PAD-2-NO80  [PAD-JUMPER-2-NO_NO_SILK_80]  92.71,60.33 0 top
SJ186  JUMPER-PAD-2-NO80  [PAD-JUMPER-2-NO_NO_SILK_80]  92.71,53.98 90 top
SJ187  JUMPER-PAD-3-NO2_80  [PAD-JUMPER-3-NO_YES_SILK_80]  98.42,60.33 90 top
SJ188  JUMPER-PAD-3-NO2_80  [PAD-JUMPER-3-NO_YES_SILK_80]  98.42,54.61 180 top
SJ189  JUMPER-PAD-2-NO80  [PAD-JUMPER-2-NO_NO_SILK_80]  105.41,59.69 0 top
SJ190  JUMPER-PAD-2-NO80  [PAD-JUMPER-2-NO_NO_SILK_80]  105.41,54.61 90 top
SJ191  JUMPER-PAD-3-NO2_80  [PAD-JUMPER-3-NO_YES_SILK_80]  110.49,54.61 0 top
SJ192  JUMPER-PAD-3-NO2_80  [PAD-JUMPER-3-NO_YES_SILK_80]  110.49,60.33 90 top
SJ193  JUMPER-PAD-3-NO3_80  [PAD-JUMPER-3-NO_YES_SILK_ALL_80]  20.32,59.69 90 top
SJ194  JUMPER-PAD-3-NO3_80  [PAD-JUMPER-3-NO_YES_SILK_ALL_80]  21.59,55.88 0 top
SJ195  JUMPER-PAD-3-NO3_80  [PAD-JUMPER-3-NO_YES_SILK_ALL_80]  33.02,59.69 90 top
SJ196  JUMPER-PAD-3-NO3_80  [PAD-JUMPER-3-NO_YES_SILK_ALL_80]  34.29,55.88 0 top
SJ197  JUMPER-PAD-3-NO3_80  [PAD-JUMPER-3-NO_YES_SILK_ALL_80]  82.87,57.78 270 top
SJ198  JUMPER-PAD-3-NO3_80  [PAD-JUMPER-3-NO_YES_SILK_ALL_80]  82.55,61.28 0 top
SJ199  JUMPER-PAD-3-NO3_80  [PAD-JUMPER-3-NO_YES_SILK_ALL_80]  70.17,57.78 270 top
SJ200  JUMPER-PAD-3-NO3_80  [PAD-JUMPER-3-NO_YES_SILK_ALL_80]  69.85,61.28 0 top

## Tracks (layer width: path | path; a pad name or v marks a point on that pad's centre or on a via)
GND
  Top 0.254: C17.2 64.77,1.27 66.67,1.27 SJ17.2 | C29.2 107.31,7.3 107.31,8.89 SJ41.2 | C30.2 103.82,5.71 105.41,5.71 SJ42.2 | C35.1 112.61,3.81 SJ43.3 | C36.1 110.49,11.64 SJ44.3 | SJ37.2 94.61,9.53 94.61,7.62 C25.2 | C26.2 90.81,5.08 92.71,5.08 SJ38.2 | SJ39.3 98.42,11.64 C33.1 | SJ40.3 96.31,3.81 C34.1 | C53.2 64.77,13.97 66.67,13.97 SJ57.2 | C65.2 107.31,20 107.31,21.59 SJ69.2 | C66.2 103.82,18.41 105.41,18.41 SJ70.2 | C71.1 112.61,16.51 SJ71.3 | C72.1 110.49,24.34 SJ72.3 | SJ65.2 94.61,22.23 94.61,20.32 C61.2 | C62.2 90.81,17.78 92.71,17.78 SJ66.2 | SJ67.3 98.42,24.34 C69.1 | SJ68.3 96.31,16.51 C70.1 | C89.2 64.77,26.67 66.67,26.67 SJ97.2 | C101.2 107.31,32.7 107.31,34.29 SJ109.2 | C102.2 103.82,31.11 105.41,31.11 SJ110.2 | C107.1 112.61,29.21 SJ111.3 | C108.1 110.49,37.05 SJ112.3 | SJ105.2 94.61,34.92 94.61,33.02 C97.2 | C98.2 90.81,30.48 92.71,30.48 SJ106.2 | SJ107.3 98.42,37.05 C105.1 | SJ108.3 96.31,29.21 C106.1 | C125.2 64.77,39.37 66.67,39.37 SJ137.2 | C137.2 107.31,45.4 107.31,46.99 SJ149.2 | C138.2 103.82,43.81 105.41,43.81 SJ150.2 | C143.1 112.61,41.91 SJ151.3 | C144.1 110.49,49.74 SJ152.3 | SJ145.2 94.61,47.62 94.61,45.72 C133.2 | C134.2 90.81,43.18 92.71,43.18 SJ146.2 | SJ147.3 98.42,49.74 C141.1 | SJ148.3 96.31,41.91 C142.1 | C161.2 64.77,52.07 66.67,52.07 SJ177.2 | C173.2 107.31,58.1 107.31,59.69 SJ189.2 | C174.2 103.82,56.52 105.41,56.52 SJ190.2 | C179.1 112.61,54.61 SJ191.3 | C180.1 110.49,62.45 SJ192.3 | SJ185.2 94.61,60.33 94.61,58.42 C169.2 | C170.2 90.81,55.88 92.71,55.88 SJ186.2 | SJ187.3 98.42,62.45 C177.1 | SJ188.3 96.31,54.61 C178.1
  pour Top: 0,101.6 165.1,101.6 165.1,0 0,0
N$1
  Top 0.254: C1.1 40.01,11.43 40.01,9.53 | 40.01,9.53 40.01,7.62 C3.2 | SJ9.1 40.01,9.53
N$2
  Top 0.254: C1.2 43.81,11.43 43.81,9.53 | 43.81,9.53 43.81,7.62 C3.1 | SJ9.2 43.81,9.53
N$3
  Top 0.254: C4.2 40.01,1.27 41.91,1.27 | 41.91,1.27 43.81,1.27 C2.1 | SJ10.1 41.91,1.27
N$4
  Top 0.254: C4.1 40.01,5.08 41.91,5.08 | 41.91,5.08 43.81,5.08 C2.2 | SJ10.2 41.91,5.08
N$5
  Top 0.254: C6.2 45.72,9.53 SJ11.2 49.53,9.53 C5.1
N$6
  Top 0.254: 47.62,8.89 SJ11.1 47.62,7.41 C5.2
N$7
  Top 0.254: C6.1 47.62,11.64 SJ11.3
N$8
  Top 0.254: C7.2 47.62,5.71 SJ12.2 47.62,1.91 C8.1
N$9
  Top 0.254: SJ12.1 49.53,3.81 49.53,1.91 C8.2
N$10
  Top 0.254: C7.1 45.72,5.71 45.72,3.81 SJ12.3
N$11
  Top 0.254: C10.2 56.52,10.48 56.52,8.89 | 56.52,8.89 56.52,7.3 C12.1 | SJ14.2 56.52,8.89
N$12
  Top 0.254: C12.2 52.7,7.3 52.7,8.89 | 52.7,8.89 52.7,10.48 C10.1 | SJ14.1 52.7,8.89
N$13
  Top 0.254: C9.1 53.02,1.91 54.61,1.91 | 54.61,1.91 56.2,1.91 C11.2 | SJ13.1 54.61,1.91
N$14
  Top 0.254: C11.1 56.2,5.71 54.61,5.71 | 54.61,5.71 53.02,5.71 C9.2 | SJ13.2 54.61,5.71
N$15
  Top 0.254: C15.2 60.33,2.22 SJ15.2 60.33,5.4 C13.1
N$16
  Top 0.254: C13.2 58.2,3.81 SJ15.1
N$17
  Top 0.254: C15.1 62.45,3.81 SJ15.3
N$18
  Top 0.254: C16.2 58.1,9.53 SJ16.2 61.28,9.53 C14.1
N$19
  Top 0.254: C14.2 59.69,7.41 SJ16.1
N$20
  Top 0.254: C16.1 59.69,11.64 SJ16.3
N$21
  Top 0.254: C17.1 64.77,5.08 66.67,5.08 SJ17.1
N$22
  Top 0.254: SJ18.1 64.77,9.53 64.77,7.62 C18.1
N$23
  Top 0.254: C37.1 40.01,24.13 40.01,22.23 | 40.01,22.23 40.01,20.32 C39.2 | SJ49.1 40.01,22.23
N$24
  Top 0.254: SJ19.2 74.93,8.89 C19.1
N$25
  Top 0.254: 73.03,8.26 SJ19.1 73.03,6.77 C19.2
N$26
  Top 0.254: SJ20.2 73.03,1.91 C20.1
N$27
  Top 0.254: 71.12,1.91 C20.2 70.91,3.81 SJ20.1
N$28
  Top 0.254: SJ33.1 77.47,8.89 77.47,7.3 C21.1
N$29
  Top 0.254: C37.2 43.81,24.13 43.81,22.23 | 43.81,22.23 43.81,20.32 C39.1 | SJ49.2 43.81,22.23
N$30
  Top 0.254: C22.1 77.79,5.71 79.38,5.71 SJ34.1
N$31
  Top 0.254: C23.1 87.31,8.89 SJ35.2
N$32
  Top 0.254: C23.2 85.72,6.77 SJ35.1
N$33
  Top 0.254: SJ36.1 83.61,3.81 C24.2
N$34
  Top 0.254: C24.1 85.72,2.22 SJ36.2
N$35
  Top 0.254: SJ37.1 90.81,9.53 90.81,7.62 C25.1
N$36
  Top 0.254: C40.2 40.01,13.97 41.91,13.97 | 41.91,13.97 43.81,13.97 C38.1 | SJ50.1 41.91,13.97
N$37
  Top 0.254: C26.1 90.81,1.27 92.71,1.27 SJ38.1
N$38
  Top 0.254: C40.1 40.01,17.78 41.91,17.78 | 41.91,17.78 43.81,17.78 C38.2 | SJ50.2 41.91,17.78
N$39
  Top 0.254: C27.1 100.33,9.53 SJ39.2 96.52,9.53 C33.2
N$40
  Top 0.254: SJ39.1 98.42,7.41 C27.2
N$41
  Top 0.254: C42.2 45.72,22.23 SJ51.2 49.53,22.23 C41.1
N$42
  Top 0.254: C28.1 98.42,1.91 SJ40.2 98.42,5.71 C34.2
N$43
  Top 0.254: SJ40.1 100.55,3.81 C28.2
N$44
  Top 0.254: 47.62,21.59 SJ51.1 47.62,20.11 C41.2
N$45
  Top 0.254: SJ41.1 103.5,8.89 103.5,7.3 C29.1
N$46
  Top 0.254: C42.1 47.62,24.34 SJ51.3
N$47
  Top 0.254: SJ42.1 105.41,1.91 103.82,1.91 C30.1
N$48
  Top 0.254: C43.2 47.62,18.41 SJ52.2 47.62,14.61 C44.1
N$49
  Top 0.254: C31.1 110.49,5.4 SJ43.2 110.49,2.22 C35.2
N$50
  Top 0.254: C31.2 108.37,3.81 SJ43.1
N$51
  Top 0.254: C32.1 112.08,9.53 SJ44.2 108.9,9.53 C36.2
N$52
  Top 0.254: C32.2 110.49,7.41 SJ44.1
N$53
  Top 0.254: SJ52.1 49.53,16.51 49.53,14.61 C44.2
N$54
  Top 0.254: C43.1 45.72,18.41 45.72,16.51 SJ52.3
N$55
  Top 0.254: C46.2 56.52,23.18 56.52,21.59 | 56.52,21.59 56.52,20 C48.1 | SJ54.2 56.52,21.59
N$56
  Top 0.254: C48.2 52.7,20 52.7,21.59 | 52.7,21.59 52.7,23.18 C46.1 | SJ54.1 52.7,21.59
N$57
  Top 0.254: C45.1 53.02,14.61 54.61,14.61 | 54.61,14.61 56.2,14.61 C47.2 | SJ53.1 54.61,14.61
N$58
  Top 0.254: C47.1 56.2,18.41 54.61,18.41 | 54.61,18.41 53.02,18.41 C45.2 | SJ53.2 54.61,18.41
N$59
  Top 0.254: C51.2 60.33,14.92 SJ55.2 60.33,18.1 C49.1
N$60
  Top 0.254: C49.2 58.2,16.51 SJ55.1
N$61
  Top 0.254: C51.1 62.45,16.51 SJ55.3
N$62
  Top 0.254: C52.2 58.1,22.23 SJ56.2 61.28,22.23 C50.1
N$63
  Top 0.254: C50.2 59.69,20.11 SJ56.1
N$64
  Top 0.254: C52.1 59.69,24.34 SJ56.3
N$65
  Top 0.254: C53.1 64.77,17.78 66.67,17.78 SJ57.1
N$66
  Top 0.254: SJ58.1 64.77,22.23 64.77,20.32 C54.1
N$67
  Top 0.254: SJ59.2 74.93,21.59 C55.1
N$68
  Top 0.254: 73.03,20.95 SJ59.1 73.03,19.47 C55.2
N$69
  Top 0.254: SJ60.2 73.03,14.61 C56.1
N$70
  Top 0.254: 71.12,14.61 C56.2 70.91,16.51 SJ60.1
N$71
  Top 0.254: SJ61.1 77.47,21.59 77.47,20 C57.1
N$72
  Top 0.254: C58.1 77.79,18.41 79.38,18.41 SJ62.1
N$73
  Top 0.254: C59.1 87.31,21.59 SJ63.2
N$74
  Top 0.254: C59.2 85.72,19.47 SJ63.1
N$75
  Top 0.254: SJ64.1 83.61,16.51 C60.2
N$76
  Top 0.254: C60.1 85.72,14.92 SJ64.2
N$77
  Top 0.254: SJ65.1 90.81,22.23 90.81,20.32 C61.1
N$78
  Top 0.254: C62.1 90.81,13.97 92.71,13.97 SJ66.1
N$79
  Top 0.254: C63.1 100.33,22.23 SJ67.2 96.52,22.23 C69.2
N$80
  Top 0.254: SJ67.1 98.42,20.11 C63.2
N$81
  Top 0.254: C64.1 98.42,14.61 SJ68.2 98.42,18.41 C70.2
N$82
  Top 0.254: SJ68.1 100.55,16.51 C64.2
N$83
  Top 0.254: SJ69.1 103.5,21.59 103.5,20 C65.1
N$84
  Top 0.254: SJ70.1 105.41,14.61 103.82,14.61 C66.1
N$85
  Top 0.254: C67.1 110.49,18.1 SJ71.2 110.49,14.92 C71.2
N$86
  Top 0.254: C67.2 108.37,16.51 SJ71.1
N$87
  Top 0.254: C68.1 112.08,22.23 SJ72.2 108.9,22.23 C72.2
N$88
  Top 0.254: C68.2 110.49,20.11 SJ72.1
N$89
  Top 0.254: C73.1 40.01,36.83 40.01,34.92 | 40.01,34.92 40.01,33.02 C75.2 | SJ89.1 40.01,34.92
N$90
  Top 0.254: C73.2 43.81,36.83 43.81,34.92 | 43.81,34.92 43.81,33.02 C75.1 | SJ89.2 43.81,34.92
N$91
  Top 0.254: C76.2 40.01,26.67 41.91,26.67 | 41.91,26.67 43.81,26.67 C74.1 | SJ90.1 41.91,26.67
N$92
  Top 0.254: C76.1 40.01,30.48 41.91,30.48 | 41.91,30.48 43.81,30.48 C74.2 | SJ90.2 41.91,30.48
N$93
  Top 0.254: C78.2 45.72,34.92 SJ91.2 49.53,34.92 C77.1
N$94
  Top 0.254: 47.62,34.29 SJ91.1 47.62,32.8 C77.2
N$95
  Top 0.254: C78.1 47.62,37.05 SJ91.3
N$96
  Top 0.254: C79.2 47.62,31.11 SJ92.2 47.62,27.3 C80.1
N$97
  Top 0.254: SJ92.1 49.53,29.21 49.53,27.3 C80.2
N$98
  Top 0.254: C79.1 45.72,31.11 45.72,29.21 SJ92.3
N$99
  Top 0.254: C82.2 56.52,35.88 56.52,34.29 | 56.52,34.29 56.52,32.7 C84.1 | SJ94.2 56.52,34.29
N$100
  Top 0.254: C84.2 52.7,32.7 52.7,34.29 | 52.7,34.29 52.7,35.88 C82.1 | SJ94.1 52.7,34.29
N$101
  Top 0.254: C81.1 53.02,27.3 54.61,27.3 | 54.61,27.3 56.2,27.3 C83.2 | SJ93.1 54.61,27.3
N$102
  Top 0.254: C83.1 56.2,31.11 54.61,31.11 | 54.61,31.11 53.02,31.11 C81.2 | SJ93.2 54.61,31.11
N$103
  Top 0.254: C87.2 60.33,27.62 SJ95.2 60.33,30.8 C85.1
N$104
  Top 0.254: C85.2 58.2,29.21 SJ95.1
N$105
  Top 0.254: C87.1 62.45,29.21 SJ95.3
N$106
  Top 0.254: C88.2 58.1,34.92 SJ96.2 61.28,34.92 C86.1
N$107
  Top 0.254: C86.2 59.69,32.8 SJ96.1
N$108
  Top 0.254: C88.1 59.69,37.05 SJ96.3
N$109
  Top 0.254: C89.1 64.77,30.48 66.67,30.48 SJ97.1
N$110
  Top 0.254: SJ98.1 64.77,34.92 64.77,33.02 C90.1
N$111
  Top 0.254: SJ99.2 74.93,34.29 C91.1
N$112
  Top 0.254: 73.03,33.66 SJ99.1 73.03,32.17 C91.2
N$113
  Top 0.254: SJ100.2 73.03,27.3 C92.1
N$114
  Top 0.254: 71.12,27.3 C92.2 70.91,29.21 SJ100.1
N$115
  Top 0.254: SJ101.1 77.47,34.29 77.47,32.7 C93.1
N$116
  Top 0.254: C94.1 77.79,31.11 79.38,31.11 SJ102.1
N$117
  Top 0.254: C95.1 87.31,34.29 SJ103.2
N$118
  Top 0.254: C95.2 85.72,32.17 SJ103.1
N$119
  Top 0.254: SJ104.1 83.61,29.21 C96.2
N$120
  Top 0.254: C96.1 85.72,27.62 SJ104.2
N$121
  Top 0.254: SJ105.1 90.81,34.92 90.81,33.02 C97.1
N$122
  Top 0.254: C98.1 90.81,26.67 92.71,26.67 SJ106.1
N$123
  Top 0.254: C99.1 100.33,34.92 SJ107.2 96.52,34.92 C105.2
N$124
  Top 0.254: SJ107.1 98.42,32.8 C99.2
N$125
  Top 0.254: C100.1 98.42,27.3 SJ108.2 98.42,31.11 C106.2
N$126
  Top 0.254: SJ108.1 100.55,29.21 C100.2
N$127
  Top 0.254: SJ109.1 103.5,34.29 103.5,32.7 C101.1
N$128
  Top 0.254: SJ110.1 105.41,27.3 103.82,27.3 C102.1
N$129
  Top 0.254: C103.1 110.49,30.8 SJ111.2 110.49,27.62 C107.2
N$130
  Top 0.254: C103.2 108.37,29.21 SJ111.1
N$131
  Top 0.254: C104.1 112.08,34.92 SJ112.2 108.9,34.92 C108.2
N$132
  Top 0.254: C104.2 110.49,32.8 SJ112.1
N$133
  Top 0.254: C109.1 40.01,49.53 40.01,47.62 | 40.01,47.62 40.01,45.72 C111.2 | SJ129.1 40.01,47.62
N$134
  Top 0.254: C109.2 43.81,49.53 43.81,47.62 | 43.81,47.62 43.81,45.72 C111.1 | SJ129.2 43.81,47.62
N$135
  Top 0.254: C112.2 40.01,39.37 41.91,39.37 | 41.91,39.37 43.81,39.37 C110.1 | SJ130.1 41.91,39.37
N$136
  Top 0.254: C112.1 40.01,43.18 41.91,43.18 | 41.91,43.18 43.81,43.18 C110.2 | SJ130.2 41.91,43.18
N$137
  Top 0.254: C114.2 45.72,47.62 SJ131.2 49.53,47.62 C113.1
N$138
  Top 0.254: 47.62,46.99 SJ131.1 47.62,45.51 C113.2
N$139
  Top 0.254: C114.1 47.62,49.74 SJ131.3
N$140
  Top 0.254: C115.2 47.62,43.81 SJ132.2 47.62,40.01 C116.1
N$141
  Top 0.254: SJ132.1 49.53,41.91 49.53,40.01 C116.2
N$142
  Top 0.254: C115.1 45.72,43.81 45.72,41.91 SJ132.3
N$143
  Top 0.254: C118.2 56.52,48.58 56.52,46.99 | 56.52,46.99 56.52,45.4 C120.1 | SJ134.2 56.52,46.99
N$144
  Top 0.254: C120.2 52.7,45.4 52.7,46.99 | 52.7,46.99 52.7,48.58 C118.1 | SJ134.1 52.7,46.99
N$145
  Top 0.254: C117.1 53.02,40.01 54.61,40.01 | 54.61,40.01 56.2,40.01 C119.2 | SJ133.1 54.61,40.01
N$146
  Top 0.254: C119.1 56.2,43.81 54.61,43.81 | 54.61,43.81 53.02,43.81 C117.2 | SJ133.2 54.61,43.81
N$147
  Top 0.254: C123.2 60.33,40.32 SJ135.2 60.33,43.5 C121.1
N$148
  Top 0.254: C121.2 58.2,41.91 SJ135.1
N$149
  Top 0.254: C123.1 62.45,41.91 SJ135.3
N$150
  Top 0.254: C124.2 58.1,47.62 SJ136.2 61.28,47.62 C122.1
N$151
  Top 0.254: C122.2 59.69,45.51 SJ136.1
N$152
  Top 0.254: C124.1 59.69,49.74 SJ136.3
N$153
  Top 0.254: C125.1 64.77,43.18 66.67,43.18 SJ137.1
N$154
  Top 0.254: SJ138.1 64.77,47.62 64.77,45.72 C126.1
N$155
  Top 0.254: SJ139.2 74.93,46.99 C127.1
N$156
  Top 0.254: 73.03,46.35 SJ139.1 73.03,44.87 C127.2
N$157
  Top 0.254: SJ140.2 73.03,40.01 C128.1
N$158
  Top 0.254: 71.12,40.01 C128.2 70.91,41.91 SJ140.1
N$159
  Top 0.254: SJ141.1 77.47,46.99 77.47,45.4 C129.1
N$160
  Top 0.254: C130.1 77.79,43.81 79.38,43.81 SJ142.1
N$161
  Top 0.254: C131.1 87.31,46.99 SJ143.2
N$162
  Top 0.254: C131.2 85.72,44.87 SJ143.1
N$163
  Top 0.254: SJ144.1 83.61,41.91 C132.2
N$164
  Top 0.254: C132.1 85.72,40.32 SJ144.2
N$165
  Top 0.254: SJ145.1 90.81,47.62 90.81,45.72 C133.1
N$166
  Top 0.254: C134.1 90.81,39.37 92.71,39.37 SJ146.1
N$167
  Top 0.254: C135.1 100.33,47.62 SJ147.2 96.52,47.62 C141.2
N$168
  Top 0.254: SJ147.1 98.42,45.51 C135.2
N$169
  Top 0.254: C136.1 98.42,40.01 SJ148.2 98.42,43.81 C142.2
N$170
  Top 0.254: SJ148.1 100.55,41.91 C136.2
N$171
  Top 0.254: SJ149.1 103.5,46.99 103.5,45.4 C137.1
N$172
  Top 0.254: SJ150.1 105.41,40.01 103.82,40.01 C138.1
N$173
  Top 0.254: C139.1 110.49,43.5 SJ151.2 110.49,40.32 C143.2
N$174
  Top 0.254: C139.2 108.37,41.91 SJ151.1
N$175
  Top 0.254: C140.1 112.08,47.62 SJ152.2 108.9,47.62 C144.2
N$176
  Top 0.254: C140.2 110.49,45.51 SJ152.1
N$177
  Top 0.254: C145.1 40.01,62.23 40.01,60.33 | 40.01,60.33 40.01,58.42 C147.2 | SJ169.1 40.01,60.33
N$178
  Top 0.254: C145.2 43.81,62.23 43.81,60.33 | 43.81,60.33 43.81,58.42 C147.1 | SJ169.2 43.81,60.33
N$179
  Top 0.254: C148.2 40.01,52.07 41.91,52.07 | 41.91,52.07 43.81,52.07 C146.1 | SJ170.1 41.91,52.07
N$180
  Top 0.254: C148.1 40.01,55.88 41.91,55.88 | 41.91,55.88 43.81,55.88 C146.2 | SJ170.2 41.91,55.88
N$181
  Top 0.254: C150.2 45.72,60.33 SJ171.2 49.53,60.33 C149.1
N$182
  Top 0.254: 47.62,59.69 SJ171.1 47.62,58.2 C149.2
N$183
  Top 0.254: C150.1 47.62,62.45 SJ171.3
N$184
  Top 0.254: C151.2 47.62,56.52 SJ172.2 47.62,52.7 C152.1
N$185
  Top 0.254: SJ172.1 49.53,54.61 49.53,52.7 C152.2
N$186
  Top 0.254: C151.1 45.72,56.52 45.72,54.61 SJ172.3
N$187
  Top 0.254: C154.2 56.52,61.28 56.52,59.69 | 56.52,59.69 56.52,58.1 C156.1 | SJ174.2 56.52,59.69
N$188
  Top 0.254: C156.2 52.7,58.1 52.7,59.69 | 52.7,59.69 52.7,61.28 C154.1 | SJ174.1 52.7,59.69
N$189
  Top 0.254: C153.1 53.02,52.7 54.61,52.7 | 54.61,52.7 56.2,52.7 C155.2 | SJ173.1 54.61,52.7
N$190
  Top 0.254: C155.1 56.2,56.52 54.61,56.52 | 54.61,56.52 53.02,56.52 C153.2 | SJ173.2 54.61,56.52
N$191
  Top 0.254: C159.2 60.33,53.02 SJ175.2 60.33,56.2 C157.1
N$192
  Top 0.254: C157.2 58.2,54.61 SJ175.1
N$193
  Top 0.254: C159.1 62.45,54.61 SJ175.3
N$194
  Top 0.254: C160.2 58.1,60.33 SJ176.2 61.28,60.33 C158.1
N$195
  Top 0.254: C158.2 59.69,58.2 SJ176.1
N$196
  Top 0.254: C160.1 59.69,62.45 SJ176.3
N$197
  Top 0.254: C161.1 64.77,55.88 66.67,55.88 SJ177.1
N$198
  Top 0.254: SJ178.1 64.77,60.33 64.77,58.42 C162.1
N$199
  Top 0.254: SJ179.2 74.93,59.69 C163.1
N$200
  Top 0.254: 73.03,59.05 SJ179.1 73.03,57.57 C163.2
N$201
  Top 0.254: SJ180.2 73.03,52.7 C164.1
N$202
  Top 0.254: 71.12,52.7 C164.2 70.91,54.61 SJ180.1
N$203
  Top 0.254: SJ181.1 77.47,59.69 77.47,58.1 C165.1
N$204
  Top 0.254: C166.1 77.79,56.52 79.38,56.52 SJ182.1
N$205
  Top 0.254: C167.1 87.31,59.69 SJ183.2
N$206
  Top 0.254: C167.2 85.72,57.57 SJ183.1
N$207
  Top 0.254: SJ184.1 83.61,54.61 C168.2
N$208
  Top 0.254: C168.1 85.72,53.02 SJ184.2
N$209
  Top 0.254: SJ185.1 90.81,60.33 90.81,58.42 C169.1
N$210
  Top 0.254: C170.1 90.81,52.07 92.71,52.07 SJ186.1
N$211
  Top 0.254: C171.1 100.33,60.33 SJ187.2 96.52,60.33 C177.2
N$212
  Top 0.254: SJ187.1 98.42,58.2 C171.2
N$213
  Top 0.254: C172.1 98.42,52.7 SJ188.2 98.42,56.52 C178.2
N$214
  Top 0.254: SJ188.1 100.55,54.61 C172.2
N$215
  Top 0.254: SJ189.1 103.5,59.69 103.5,58.1 C173.1
N$216
  Top 0.254: SJ190.1 105.41,52.7 103.82,52.7 C174.1
N$217
  Top 0.254: C175.1 110.49,56.2 SJ191.2 110.49,53.02 C179.2
N$218
  Top 0.254: C175.2 108.37,54.61 SJ191.1
N$219
  Top 0.254: C176.1 112.08,60.33 SJ192.2 108.9,60.33 C180.2
N$220
  Top 0.254: C176.2 110.49,58.2 SJ192.1

## Text on the board
Reference: 70% | 60% | 50% | Ground1 | Ground2 | Island | NoStop | Normal | Tight | Ground1 | Tight | Ground2 | Tight | 180% | 160% | 140% | 120% | 100%